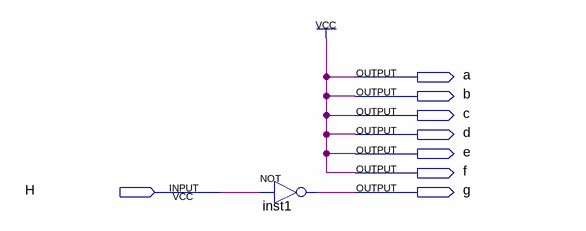
[diagram p0: schematic sheet]
// Quartus schematic bcd_signal.bdf as structural Verilog: 1 symbols, 8 pins
module bcd_signal (
  input  H,
  output a,
  output b,
  output c,
  output d,
  output e,
  output f,
  output g
);

  not inst1 (g, H);

  assign a = 1'b1;
  assign b = 1'b1;
  assign c = 1'b1;
  assign d = 1'b1;
  assign e = 1'b1;
  assign f = 1'b1;
endmodule
